# EAGLE design nanino (EAGLE 7.3.0)
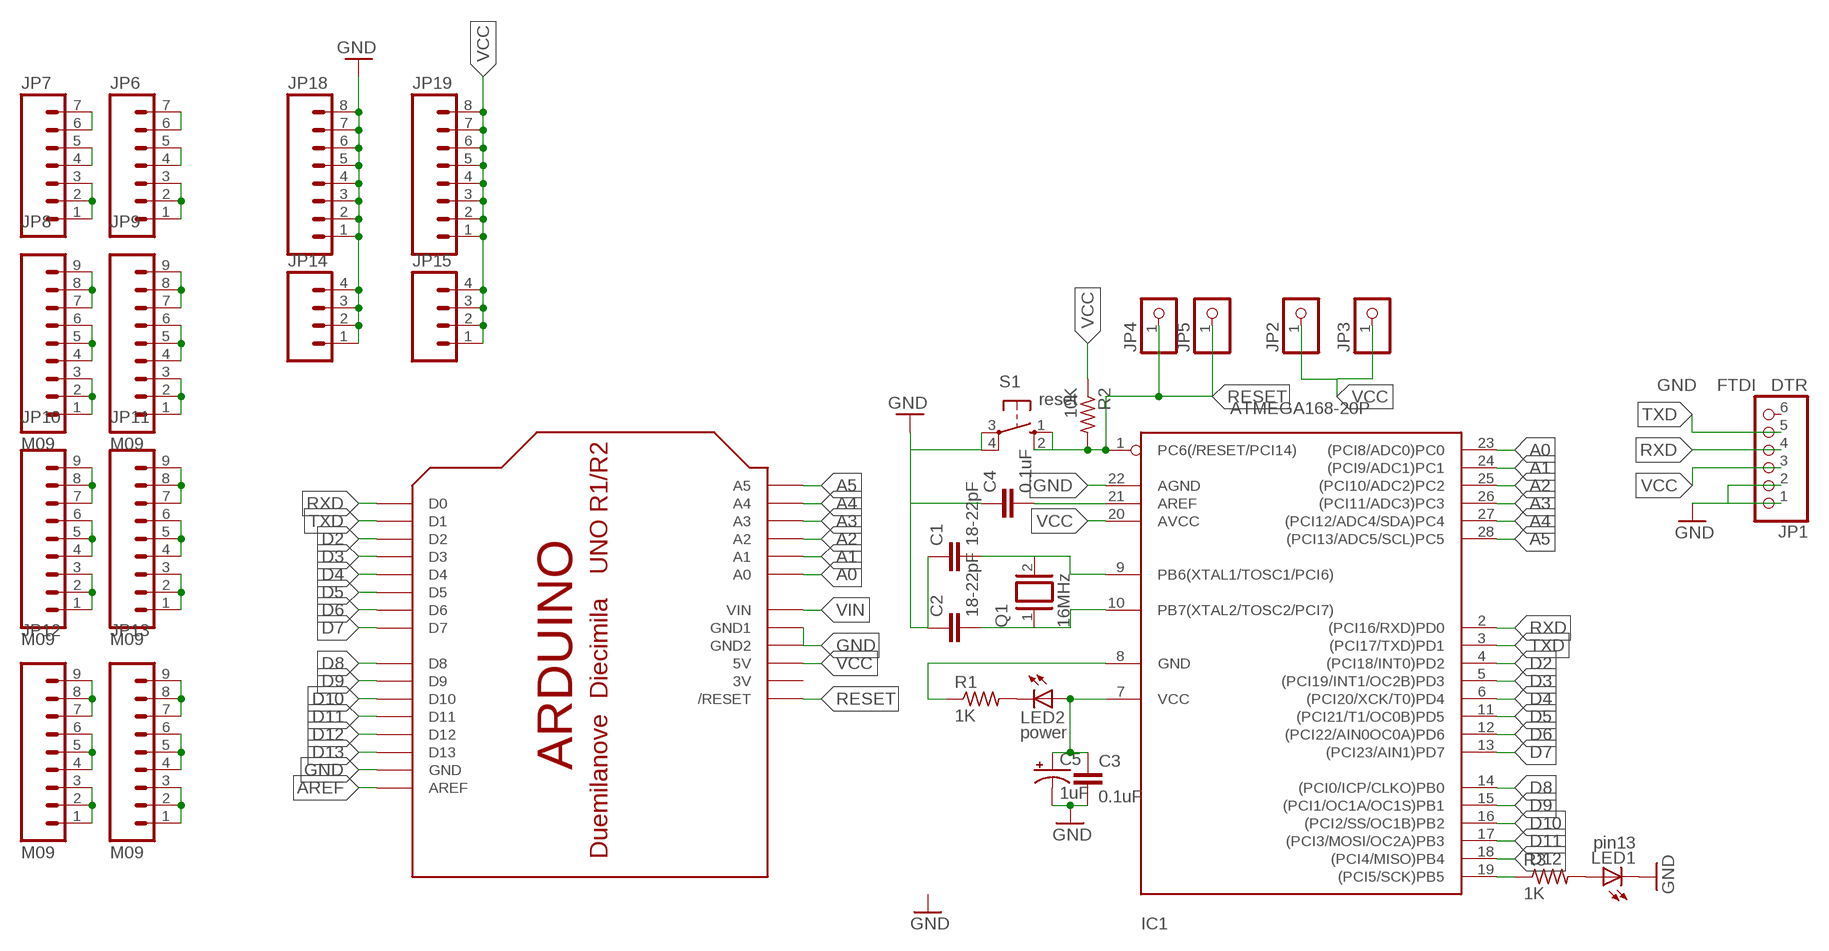
[diagram p0: schematic, sheet 1]

## Parts
C1  18-22pF  C-EU025-030X050  [C025-030X050]
C2  18-22pF  C-EU025-030X050  [C025-030X050]
C3  0.1uF  C-EU025-030X050  [C025-030X050]
C4  0.1uF  C-EU025-030X050  [C025-030X050]
C5  1uF  CPOL-USE2.5-6  [E2,5-6]
IC1  ATMEGA168-20P  [DIL28-3]
JP1  GND FTDI DTR  PINHD-1X6  [1X06]
JP2  PINHD-1X1CB  [1X01-CLEANBIG]
JP3  PINHD-1X1CB  [1X01-CLEANBIG]
JP4  PINHD-1X1CB  [1X01-CLEANBIG]
JP5  PINHD-1X1CB  [1X01-CLEANBIG]
JP6  M07  [1X07]
JP7  M07  [1X07]
JP8  M09  [1X09]
JP9  M09  [1X09]
JP10  M09  [1X09]
JP11  M09  [1X09]
JP12  M09  [1X09]
JP13  M09  [1X09]
JP14  M04PTH  [1X04]
JP15  M04PTH  [1X04]
JP18  M081X08  [1X08]
JP19  M081X08  [1X08]
LED1  pin13  LED3MM  [LED3MM]
LED2  power  LED3MM  [LED3MM]
Q1  16MHz  XTAL/S  [QS]
R1  1K  R-US_0207/10  [0207/10]
R2  10K  R-US_0207/10  [0207/10]
R3  1K  R-US_0207/10  [0207/10]
S1  reset  10-XX  [B3F-10XX]
U$1  ARDUINOUNO  [ARDUINO]

## Nets
A0: IC1.23((PCI8/ADC0)PC0) U$1.A0
A1: IC1.24((PCI9/ADC1)PC1) U$1.A1
A2: IC1.25((PCI10/ADC2)PC2) U$1.A2
A3: IC1.26((PCI11/ADC3)PC3) U$1.A3
A4: IC1.27((PCI12/ADC4/SDA)PC4) U$1.A4
A5: IC1.28((PCI13/ADC5/SCL)PC5) U$1.A5
AREF: C4.2 IC1.21(AREF) U$1.AREF
D2: IC1.4((PCI18/INT0)PD2) U$1.D2
D3: IC1.5((PCI19/INT1/OC2B)PD3) U$1.D3
D4: IC1.6((PCI20/XCK/T0)PD4) U$1.D4
D5: IC1.11((PCI21/T1/OC0B)PD5) U$1.D5
D6: IC1.12((PCI22/AIN0OC0A)PD6) U$1.D6
D7: IC1.13((PCI23/AIN1)PD7) U$1.D7
D8: IC1.14((PCI0/ICP/CLKO)PB0) U$1.D8
D9: IC1.15((PCI1/OC1A/OC1S)PB1) U$1.D9
D10: IC1.16((PCI2/SS/OC1B)PB2) U$1.D10
D11: IC1.17((PCI3/MOSI/OC2A)PB3) U$1.D11
D12: IC1.18((PCI4/MISO)PB4) U$1.D12
D13: IC1.19((PCI5/SCK)PB5) R3.1 U$1.D13
GND: C1.1 C2.1 C3.2 C4.1 C5.- IC1.8(GND) IC1.22(AGND) JP1.1 JP1.2 JP14.1 JP14.2 JP14.3 JP14.4 JP18.1 JP18.2 JP18.3 JP18.4 JP18.5 JP18.6 JP18.7 JP18.8 LED1.K(C) R1.1 S1.3(P) S1.4(P1) U$1.GND U$1.GND1 U$1.GND2
N$1: C1.2 IC1.9(PB6(XTAL1/TOSC1/PCI6)) Q1.2
N$2: C2.2 IC1.10(PB7(XTAL2/TOSC2/PCI7)) Q1.1
N$3: LED2.K(C) R1.2
N$4: LED1.A R3.2
N$5: JP9.1 JP9.2 JP9.3
N$7: JP9.4 JP9.5 JP9.6
N$8: JP9.7 JP9.8 JP9.9
N$9: JP11.1 JP11.2 JP11.3
N$10: JP11.4 JP11.5 JP11.6
N$11: JP11.7 JP11.8 JP11.9
N$12: JP13.1 JP13.2 JP13.3
N$13: JP13.4 JP13.5 JP13.6
N$14: JP13.7 JP13.8 JP13.9
N$15: JP12.1 JP12.2 JP12.3
N$16: JP12.4 JP12.5 JP12.6
N$17: JP12.7 JP12.8 JP12.9
N$18: JP10.1 JP10.2 JP10.3
N$19: JP10.4 JP10.5 JP10.6
N$20: JP10.7 JP10.8 JP10.9
N$21: JP8.1 JP8.2 JP8.3
N$22: JP8.4 JP8.5 JP8.6
N$23: JP8.7 JP8.8 JP8.9
N$24: JP6.1 JP6.2 JP6.3
N$25: JP6.6 JP6.7
N$26: JP7.1 JP7.2 JP7.3
N$27: JP7.6 JP7.7
N$28: JP6.4 JP6.5
N$29: JP7.4 JP7.5
RESET: IC1.1(PC6(/RESET/PCI14)) JP4.1 JP5.1 R2.2 S1.1(S) U$1.RESET(/RESET)
RXD: IC1.2((PCI16/RXD)PD0) JP1.4 U$1.D0
TXD: IC1.3((PCI17/TXD)PD1) JP1.5 U$1.D1
VCC: C3.1 C5.+ IC1.7(VCC) IC1.20(AVCC) JP1.3 JP2.1 JP3.1 JP15.1 JP15.2 JP15.3 JP15.4 JP19.1 JP19.2 JP19.3 JP19.4 JP19.5 JP19.6 JP19.7 JP19.8 LED2.A R2.1 U$1.5V
VIN: U$1.VIN
Unconnected: JP1.6 S1.2(S1)

## Power pins joined to a net without a drawn wire
3V: U$1.3V

## Library data of the parts
C1-C4 = rcl:C-EU: CAPACITOR, European symbol
C5 = adafruit:CPOL-US: POLARIZED CAPACITOR, American symbol
IC1 = adafruit:ATMEGA168*P: MICROCONTROLLER 16 kBytes FLASH 1 kBytes SRAM 512 Bytes EEPROM USART 8-channel 10 bit ADC
JP1 = adafruit:PINHD-1X6: PIN HEADER
JP2-JP5 = adafruit:PINHD-1X1: Pin header 1x1 for 0.1" spacing With round pins
JP6 JP7 = SparkFun-Connectors:M07: Header 7 Standard 7-pin 0.1" header. Use with straight break away headers (SKU : PRT-00116), right angle break away headers (PRT-00553), swiss pins (PRT-00743), machine pins (PRT-00117), and female headers (PRT-00115). NOTES ON THE VARIANTS LOCK and LOCK_LONGPADS... This footprint was designed to help hold the alignment of a through-hole component (i.e. 7-pin header) while soldering it into place. You may notice that each hole has been shifted either up or down by 0.005 of an inch from it's more standard position (which is usually a perfectly straight line). This slight alteration caused the pins (the squares in the middle) to touch the edges of the holes. Because they are alternating, it causes a "brace" to hold the header in place. 0.005 has proven to be the perfect amount of "off-center" position when using our standard breakaway headers. Although looks a little odd when you look at the bare footprint, once you have a header in there, the alteration is very hard to notice. Also, if you push a header all the way into place, it is covered up entirely on the bottom side. This idea of altering the position of holes to aid alignment will be further integrated into the Sparkfun Library for other footprints. It can help hold any component with 3 or more connection pins.
JP8-JP13 = SparkFun-Connectors:M09: Header 9 Standard 9-pin 0.1" header. Use with straight break away headers (SKU : PRT-00116), right angle break away headers (PRT-00553), swiss pins (PRT-00743), machine pins (PRT-00117), and female headers (PRT-00115).
JP14 JP15 = SparkFun-Connectors:M04: Header 4 Standard 4-pin 0.1" header. Use with straight break away headers (SKU : PRT-00116), right angle break away headers (PRT-00553), swiss pins (PRT-00743), machine pins (PRT-00117), and female headers (PRT-00115). Molex polarized connector foot print use with SKU : PRT-08231 with associated crimp pins and housings. 1MM SMD Version SKU: PRT-10208
JP18 JP19 = SparkFun-Connectors:M08: Header 8 Standard 8-pin 0.1" header. Use with straight break away headers (SKU : PRT-00116), right angle break away headers (PRT-00553), swiss pins (PRT-00743), machine pins (PRT-00117), and female headers (PRT-00115).
LED1 LED2 = adafruit:LED: LED OSRAM: - CHIPLED LG R971, LG N971, LY N971, LG Q971, LY Q971, LO R971, LY R971 LH N974, LH R974 LS Q976, LO Q976, LY Q976 LO Q996 - Hyper CHIPLED LW Q18S LB Q993, LB Q99A, LB R99A - SideLED LS A670, LO A670, LY A670, LG A670, LP A670 LB A673, LV A673, LT A673, LW A673 LH A674 LY A675 LS A676, LA A676, LO A676, LY A676, LW A676 LS A679, LY A679, LG A679 - Hyper Micro SIDELED® LS Y876, LA Y876, LO Y876, LY Y876 LT Y87S - SmartLED LW L88C, LW L88S LB L89C, LB L89S, LG L890 LS L89K, LO L89K, LY L89K LS L896, LA L896, LO L896, LY L896 - TOPLED LS T670, LO T670, LY T670, LG T670, LP T670 LSG T670, LSP T670, LSY T670, LOP T670, LYG T670 LG T671, LOG T671, LSG T671 LB T673, LV T673, LT T673, LW T673 LH T674 LS T676, LA T676, LO T676, LY T676, LB T676, LH T676, LSB T676, LW T676 LB T67C, LV T67C, LT T67C, LS T67K, LO T67K, LY T67K, LW E67C LS E67B, LA E67B, LO E67B, LY E67B, LB E67C, LV E67C, LT E67C LW T67C LS T679, LY T679, LG T679 LS T770, LO T770, LY T770, LG T770, LP T770 LB T773, LV T773, LT T773, LW T773 LH T774 LS E675, LA E675, LY E675, LS T675 LS T776, LA T776, LO T776, LY T776, LB T776 LHGB T686 LT T68C, LB T68C - Hyper Mini TOPLED® LB M676 - Mini TOPLED Santana® LG M470 LS M47K, LO M47K, LY M47K Source: http://www.osram.convergy.de/
Q1 = special:XTAL/S: CRYSTAL
R1-R3 = adafruit:R-US_: RESISTOR, American symbol
S1 = switch-omron:10-XX: OMRON SWITCH; MPN: B3F-1000; OC_FARNELL: 176432; OC_NEWARK: 36M3542
U$1 = adafruit:ARDUINO: Arduino Diecimila/Duemilanove Make a shield with ease, this package has all the named pins as well as the two mounting drill holes and an outline of the USB and DC power connector. The outline is on the DIMENSION layer, so if your board house uses it they will cut the outline to match. http://www.ladyada.net/library/pcb/eaglelibrary.html

## Net classes
0 default: width 0.813 mm

## Board
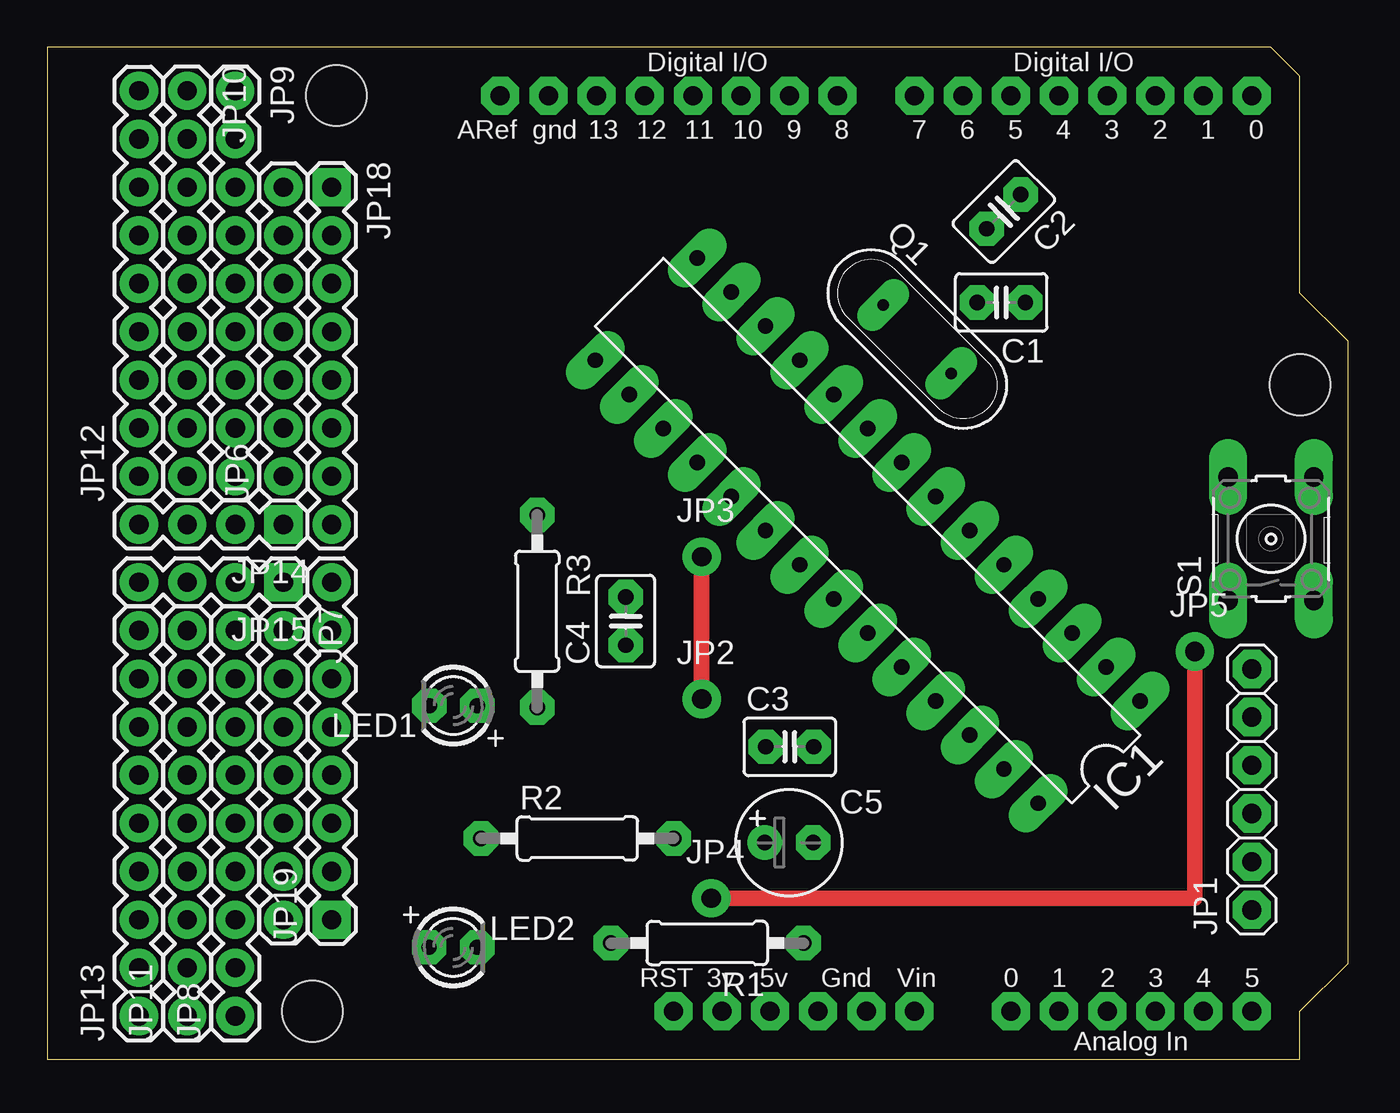
[diagram p1: board, top side]
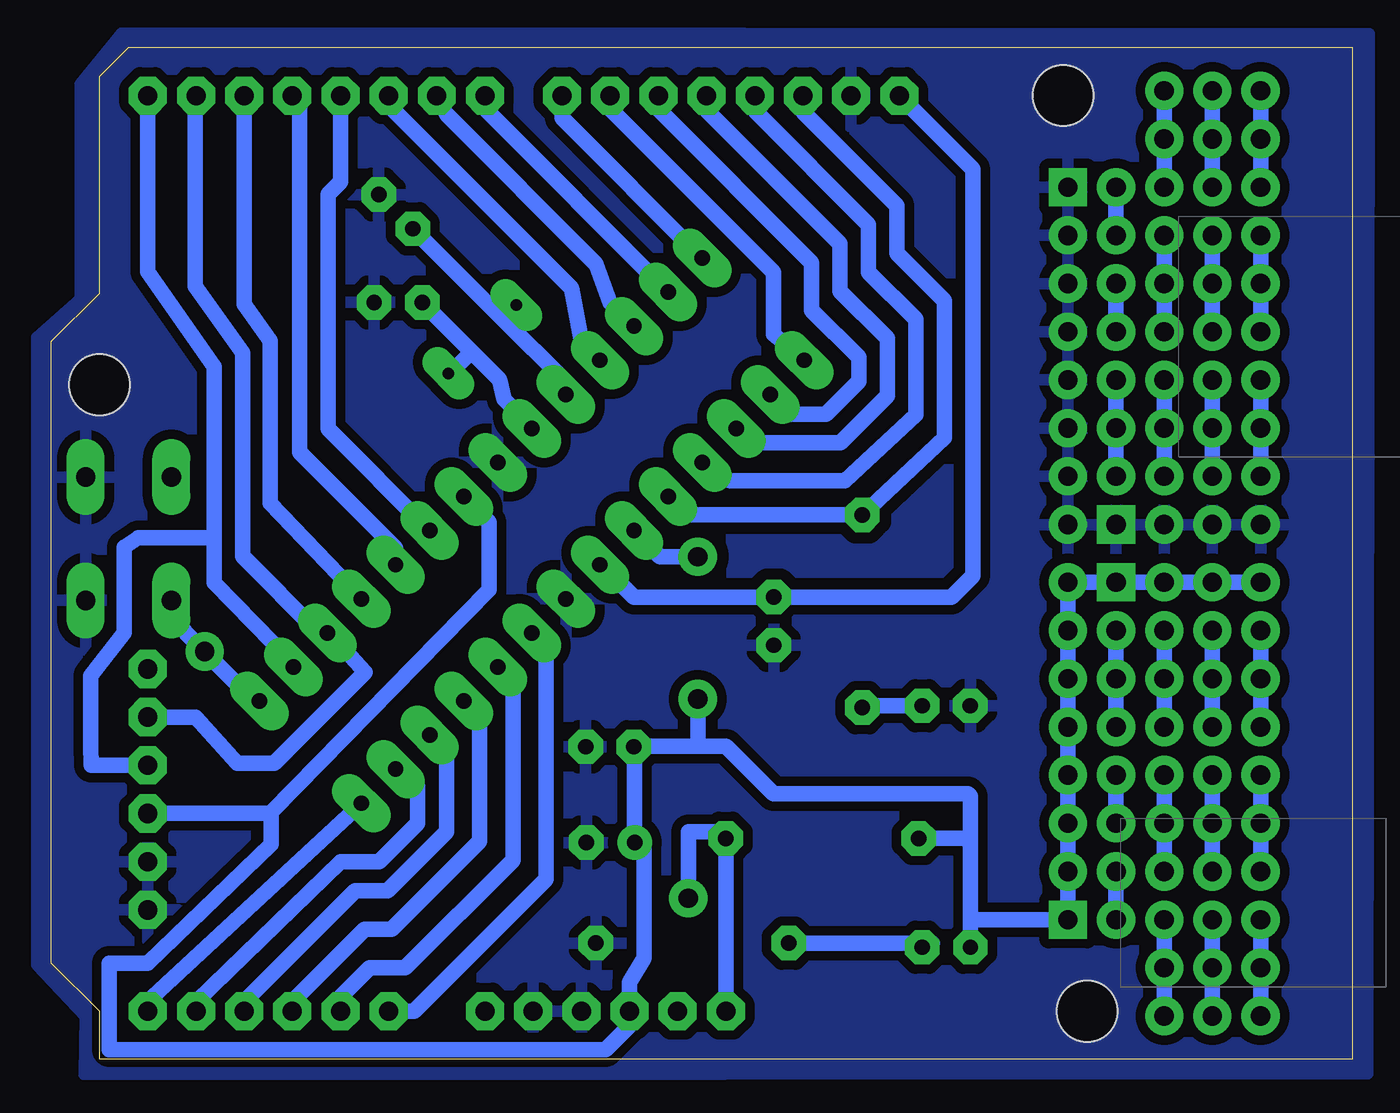
[diagram p2: board, bottom side, seen from below]

Size 68.58 x 53.34 mm. Coordinates in mm from the lower left corner, seen from the top.
Copper layers (1*16): Top 0.035mm / dielectric 1.5mm / Bottom 0.035mm
Design rules "FablabImperia DRC v2  *": minimum track width 0.33mm, minimum drill 0.8mm, track to track 0.5mm, track to pad 0.6mm, pad to pad 0.2mm, via to via 0.2mm, smd to smd 0.2mm, copper to edge 0mil, drill to drill 8mil, minimum pad ring 0.5mm, minimum via ring 0.5mm, stop-mask expansion 0mil, vias tented up to drill 0mil, thermal gap 20mil

### Footprints (pad centres in the part's own frame; a part is rotated, then mirrored left to right if it is on the bottom)
C025-030X050 = drill 0.813 octagon: 1 -1.27,0; 2 1.27,0
E2,5-6 = drill 0.813 pad 1.778: + -1.27,0 | drill 0.813 pad 1.778 octagon: - 1.27,0
DIL28-3 = drill 0.813 long: 1 -16.51,-3.81; 2 -13.97,-3.81; 3 -11.43,-3.81; 4 -8.89,-3.81; 5 -6.35,-3.81; 6 -3.81,-3.81; 7 -1.27,-3.81; 8 1.27,-3.81; 9 3.81,-3.81; 10 6.35,-3.81; 11 8.89,-3.81; 12 11.43,-3.81; 13 13.97,-3.81; 14 16.51,-3.81; 15 16.51,3.81; 16 13.97,3.81; 17 11.43,3.81; 18 8.89,3.81; 19 6.35,3.81; 20 3.81,3.81; 21 1.27,3.81; 22 -1.27,3.81; 23 -3.81,3.81; 24 -6.35,3.81; 25 -8.89,3.81; 26 -11.43,3.81; 27 -13.97,3.81; 28 -16.51,3.81
1X06 = drill 1.016 octagon: 1 -6.35,0; 2 -3.81,0; 3 -1.27,0; 4 1.27,0; 5 3.81,0; 6 6.35,0
1X01-CLEANBIG = drill 1.016 pad 1.778: 1 0,0
1X07 = drill 1.016 pad 1.88: 1 0,0; 2 2.54,0; 3 5.08,0; 4 7.62,0; 5 10.16,0; 6 12.7,0; 7 15.24,0
1X09 = drill 1.016 pad 1.88: 1 0,0; 2 2.54,0; 3 5.08,0; 4 7.62,0; 5 10.16,0; 6 12.7,0; 7 15.24,0; 8 17.78,0; 9 20.32,0
1X04 = drill 1.016 pad 1.88 square: 1 0,0 | drill 1.016 pad 1.88: 2 2.54,0; 3 5.08,0; 4 7.62,0
1X08 = drill 1.016 pad 1.88 square: 1 0,0 | drill 1.016 pad 1.88: 2 2.54,0; 3 5.08,0; 4 7.62,0; 5 10.16,0; 6 12.7,0; 7 15.24,0; 8 17.78,0
LED3MM = drill 0.813 pad 1.676 octagon: A -1.27,0; K 1.27,0
QS = drill 0.61 long: 1 -2.54,0; 2 2.54,0
0207/10 = drill 0.813 pad 1.676 octagon: 1 -5.08,0; 2 5.08,0
B3F-10XX = drill 1.016 long: 1 -3.251,2.261; 2 3.251,2.261; 3 -3.251,-2.261; 4 3.251,-2.261
ARDUINO = drill 1 pad 1.676 octagon: 3V 35.56,2.54; 5V 38.1,2.54; A0 50.8,2.54; A1 53.34,2.54; A2 55.88,2.54; A3 58.42,2.54; A4 60.96,2.54; A5 63.5,2.54; AREF 23.876,50.8; D0 63.5,50.8; D1 60.96,50.8; D2 58.42,50.8; D3 55.88,50.8; D4 53.34,50.8; D5 50.8,50.8; D6 48.26,50.8; D7 45.72,50.8; D8 41.656,50.8; D9 39.116,50.8; D10 36.576,50.8; D11 34.036,50.8; D12 31.496,50.8; D13 28.956,50.8; GND 26.416,50.8; GND1 43.18,2.54; GND2 40.64,2.54; RESET 33.02,2.54; VIN 45.72,2.54 | hole 3.2: 15.24,50.8; 66.04,35.56; 13.97,2.54

### Placement (x,y rotation side)
C1  50.3,39.9 180 top
C2  50.43,44.68 225 top
C3  39.14,16.48 0 top
C4  30.49,23.1 90 top
C5  39.1,11.43 0 top
IC1  43.25,27.87 135 top
JP1  63.51,14.23 90 top
JP2  34.5,19 0 top
JP3  34.5,26.5 0 top
JP4  35,8.5 0 top
JP5  60.5,21.5 0 top
JP6  12.45,30.73 90 top
JP7  12.45,22.61 270 top
JP8  9.91,2.29 90 top
JP9  9.91,51.05 270 top
JP10  7.37,51.05 270 top
JP11  7.37,2.29 90 top
JP12  4.83,30.73 90 top
JP13  4.83,2.29 90 top
JP14  12.45,28.19 180 top
JP15  12.45,25.15 180 top
JP18  14.99,45.97 270 top
JP19  14.99,7.37 90 top
LED1  21.4,18.64 180 top
LED2  21.39,5.91 0 top
Q1  45.86,37.96 315 top
R1  34.79,6.13 180 top
R2  27.94,11.65 0 top
R3  25.82,23.62 270 top
S1  64.52,27.44 90 top
U$1  0,0 0 top

### Tracks (layer width: path | path; a pad name or v marks a point on that pad's centre or on a via)
A0
  Bottom 0.813: IC1.23 42.49,22.23 42.49,9.5 49.45,2.54 U$1.A0
A1
  Bottom 0.813: IC1.24 44.25,20.14 44.25,10.5 49.92,4.83 51.82,4.83 53.34,3.3 U$1.A1
A2
  Bottom 0.813: IC1.25 46,18.05 46,11.5 50.64,6.86 52.07,6.86 55.88,3.05 U$1.A2
A3
  Bottom 0.813: IC1.26 47.75,16.46 47.75,12 50.86,8.89 52.58,8.89 58.42,3.05 U$1.A3
A4
  Bottom 0.813: U$1.A4 60.96,3.05 53.34,10.41 51.31,10.41 49.28,12.45 49.28,14.39 50.18,15.3 IC1.27
A5
  Bottom 0.813: IC1.28 63.25,3.3 U$1.A5
AREF
  Bottom 0.813: U$1.AREF 20,46.92 20,25.5 21.13,24.37 C4.2 37.87,24.37 39.57,26.07 IC1.21
D2
  Bottom 0.813: U$1.D2 58.42,39.81 57.05,37.89 57.05,29.3 IC1.4
D3
  Bottom 0.813: IC1.5 50.43,26.93 55.5,32 55.5,50.42 U$1.D3
D4
  Bottom 0.813: U$1.D4 53.34,46.26 54,45.6 54,33.23 IC1.6
D5
  Bottom 0.813: IC1.11 40.64,37.83 41.15,40.64 50.8,50.29 U$1.D5
D6
  Bottom 0.813: U$1.D6 47.75,49.81 39.88,41.91 39.12,39.88 IC1.12
D7
  Bottom 0.813: U$1.D7 45.72,50.1 IC1.13
D8
  Bottom 0.813: U$1.D8 41.66,49.62 IC1.14
D9
  Bottom 0.813: U$1.D9 39.12,50.12 30.5,41.5 30.5,38.22 IC1.15
D10
  Bottom 0.813: U$1.D10 36.58,50.08 28.5,42 28.5,39.5 26,37 26,35.74 27.74,34 29.62,34 IC1.16
D11
  Bottom 0.813: U$1.D11 34.04,50.04 27,43 27,40.5 24.5,38 24.5,34.98 26.98,32.5 31.21,32.5 IC1.17
D12
  Bottom 0.813: U$1.D12 31.5,50 25.5,44 25.5,41.5 23,39 23,33.98 26.75,30.49 32.79,30.49 IC1.18
D13
  Bottom 0.813: U$1.D13 28.96,49.96 24,45 24,42.5 21.5,40 21.5,32.77 R3.1 35.05,28.7 IC1.19
GND
  pour Bottom: 64.85,54.12 67.06,51.4 67.06,40.1 69.36,38.05 69.36,5 66.8,2.29 66.86,-0.81 -0.82,-0.75 -0.92,54.06
  pour Bottom (isolate 0.61): 20.32,25.4 20.32,32.51 21.84,32.51 21.84,32.26 26.67,27.94 34.04,27.94 34.04,24.38 21.34,24.38
N$1
  Bottom 0.813: IC1.9 43.25,33.36 44.7,34.8 44.96,35.81 46.44,37.31 | 46.44,37.31 C1.2 | Q1.2 47.66,36.09 46.44,37.31
N$2
  Bottom 0.813: IC1.10 41.45,35.71 44.87,39.13 | 44.87,39.13 C2.2 | Q1.1 44.24,39.76 44.87,39.13
N$3
  Bottom 0.813: R1.2 22.13,6.13 LED2.K
N$4
  Bottom 0.813: LED1.A 25.82,18.64 R3.2
N$5
  Bottom 0.813: JP9.3 JP9.2 JP9.1
N$6
  pour Bottom: 0,52.32 2.79,52.32 2.79,0.25 0,0.25
  pour Bottom: 16.51,3.81 31.24,3.81 31.24,0.51 16.51,0.51
N$7
  Bottom 0.813: JP9.6 JP9.5 JP9.4
N$8
  Bottom 0.813: JP9.9 JP9.8 JP9.7
N$9
  Bottom 0.813: JP11.1 JP11.2 JP11.3
N$10
  Bottom 0.813: JP11.4 JP11.5 JP11.6
N$11
  Bottom 0.813: JP11.7 JP11.8 JP11.9
N$12
  Bottom 0.813: JP13.3 JP13.2 JP13.1
N$13
  Bottom 0.813: JP13.6 JP13.5 JP13.4
N$14
  Bottom 0.813: JP13.9 JP13.8 JP13.7
N$15
  Bottom 0.813: JP12.1 JP12.2 JP12.3
N$16
  Bottom 0.813: JP12.4 JP12.5 JP12.6
N$17
  Bottom 0.813: JP12.7 JP12.8 JP12.9
N$18
  Bottom 0.813: JP10.3 JP10.2 JP10.1
N$19
  Bottom 0.813: JP10.6 JP10.5 JP10.4
N$20
  Bottom 0.813: JP10.9 JP10.8 JP10.7
N$21
  Bottom 0.813: JP8.3 JP8.2 JP8.1
N$22
  Bottom 0.813: JP8.6 JP8.5 JP8.4
N$23
  Bottom 0.813: JP8.9 JP8.8 JP8.7
N$24
  Bottom 0.813: JP6.1 JP6.2 JP6.3
N$25
  Bottom 0.813: JP6.6 JP6.7
N$26
  Bottom 0.813: JP7.1 JP7.2 JP7.3
N$27
  Bottom 0.813: JP7.6 JP7.7
N$28
  Bottom 0.813: JP6.4 JP6.5
N$29
  Bottom 0.813: JP7.4 JP7.5
RESET
  Top 0.813: JP4.1 60.5,8.5 JP5.1
  Bottom 0.813: U$1.RESET R2.2 33.37,12 35,12 JP4.1 | IC1.1 57.89,18.89 JP5.1 62.51,23.51 S1.1
RXD
  Bottom 0.813: IC1.2 55.82,20.82 60.01,25.14 60.01,27.5 | 60.01,27.5 60.01,36.5 63.5,41.52 U$1.D0 | JP1.4 66.49,15.5 66.5,16.52 66.5,20.23 64.75,22.49 64.75,27.01 64,27.5 60.01,27.5
TXD
  Bottom 0.813: JP1.5 60.98,18.04 58.8,15.6 56.84,15.6 52.04,20.4 52.8,21.26 IC1.3 54.48,22.48 58.51,26.51 58.51,37.25 61,40.76 61,50.76 U$1.D1
VCC
  Top 0.813: JP2.1 JP3.1
  Bottom 0.813: 56.98,13.02 45.5,24.75 45.5,28.32 IC1.7 | LED2.A 20.12,7.37 | 20.12,7.37 20.12,11.5 | 20.12,11.5 20.12,13.87 20.25,14 30.5,14 33,16.5 34.5,16.5 | 34.5,16.5 37.85,16.5 C3.1 37.83,16.44 C5.+ 37.34,11.16 37.34,5.33 38.1,4.06 U$1.5V 38.1,1.78 39.37,0.51 65.53,0.51 65.53,5.08 63.5,5.08 56.98,11.34 56.98,13.02 | R2.1 20.53,11.65 20.12,11.5 | JP2.1 34.5,16.5 | JP3.1 36.49,26.5 IC1.20 | JP1.3 57.04,12.96 56.98,13.02 | JP19.1 14.73,7.37 | JP19.1 20.12,7.37 | JP19.1 JP19.2 JP19.3 JP19.4 JP19.5 JP19.6 JP19.7 JP19.8 JP15.1 JP15.2 JP15.3 JP15.4

### Text on the board
bRestrict: NANINO 0.8 (CC-BY-NC-SA) | Rev. 00